# Altium schematic sheet Photon.SchDoc
size A4; DrawnBy: Aaron Huinink; SheetNumber: 1; SheetTotal: 1
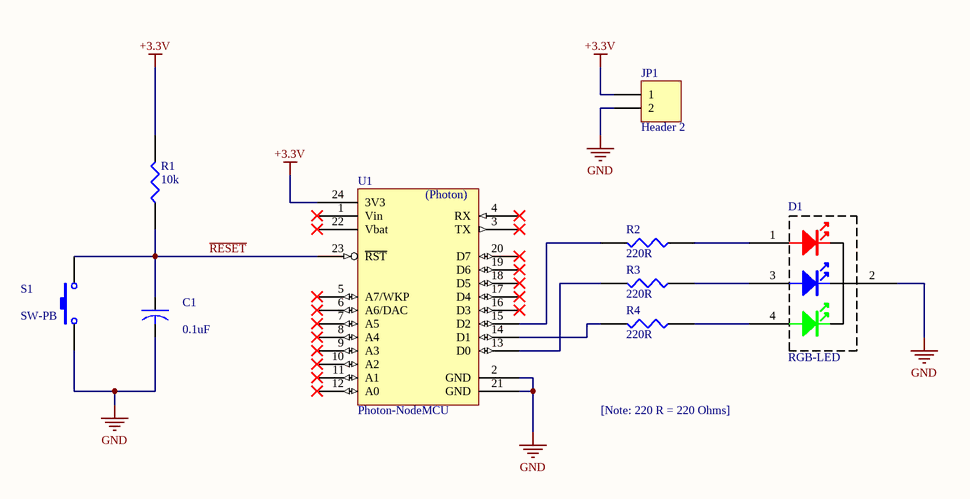
[diagram p0: Photon.SchDoc]

## Parts
C1  0.1uF  [RAD0.2]
D1  RGB-LED  [RGB-LED]
JP1  Header 2  [HDR1X2]
R1  10k  [axial0.5]
R2  220R  [axial0.5]
R3  220R  [axial0.5]
R4  220R  [axial0.5]
S1  SW-PB  [SPST-2]
U1  Photon-NodeMCU  [PHOTONNODE_TH]

## Nets
+3.3V: JP1.1 R1.2 U1.24(3V3)
GND: C1.2 D1.2 JP1.2 S1.1 U1.2(GND) U1.21(GND)
~{RESET}: C1.1 R1.1 S1.2 U1.23(~{RST})
NetD1_1: D1.1 R2.1
NetD1_3: D1.3 R3.1
NetD1_4: D1.4 R4.1
NetR2_2: R2.2 U1.15(D2)
NetR3_2: R3.2 U1.13(D0)
NetR4_2: R4.2 U1.14(D1)

Not connected (* = marked no-connect by the designer): U1 1(Vin)* 3(TX)* 4(RX)* 5(A7/WKP)* 6(A6/DAC)* 7(A5)* 8(A4)* 9(A3)* 10(A2)* 11(A1)* 12(A0)* 16(D3)* 17(D4)* 18(D5)* 19(D6)* 20(D7)* 22(Vbat)*

## Notes on the sheet
- [Note: 220 R = 220 Ohms]
- (in symbol Photon-NodeMCU) (Photon)

## Library data of the parts
C1 = CAPACITOR: Non-polarized Electrolytic Capacitor
D1 = RGB-LED: RGB Capable LED
JP1 = Header 2: Header, 2-Pin; Revision: 17-Jul-2002: Re-released for DXP Platform.; Publisher: Altium Limited
R1-R4 = RES1: Resistor
S1 = SW-PB: Push-button Switch; Published: 24-Mar-1999; LatestRevisionDate: 17-Jul-2002; LatestRevisionNote: Re-released for DXP Platform.; PackageReference: SPST-2; Publisher: Altium Limited; PackageDescription: Switch; 2 Leads